# EAGLE schematic Transponder (EAGLE 9.5.1)
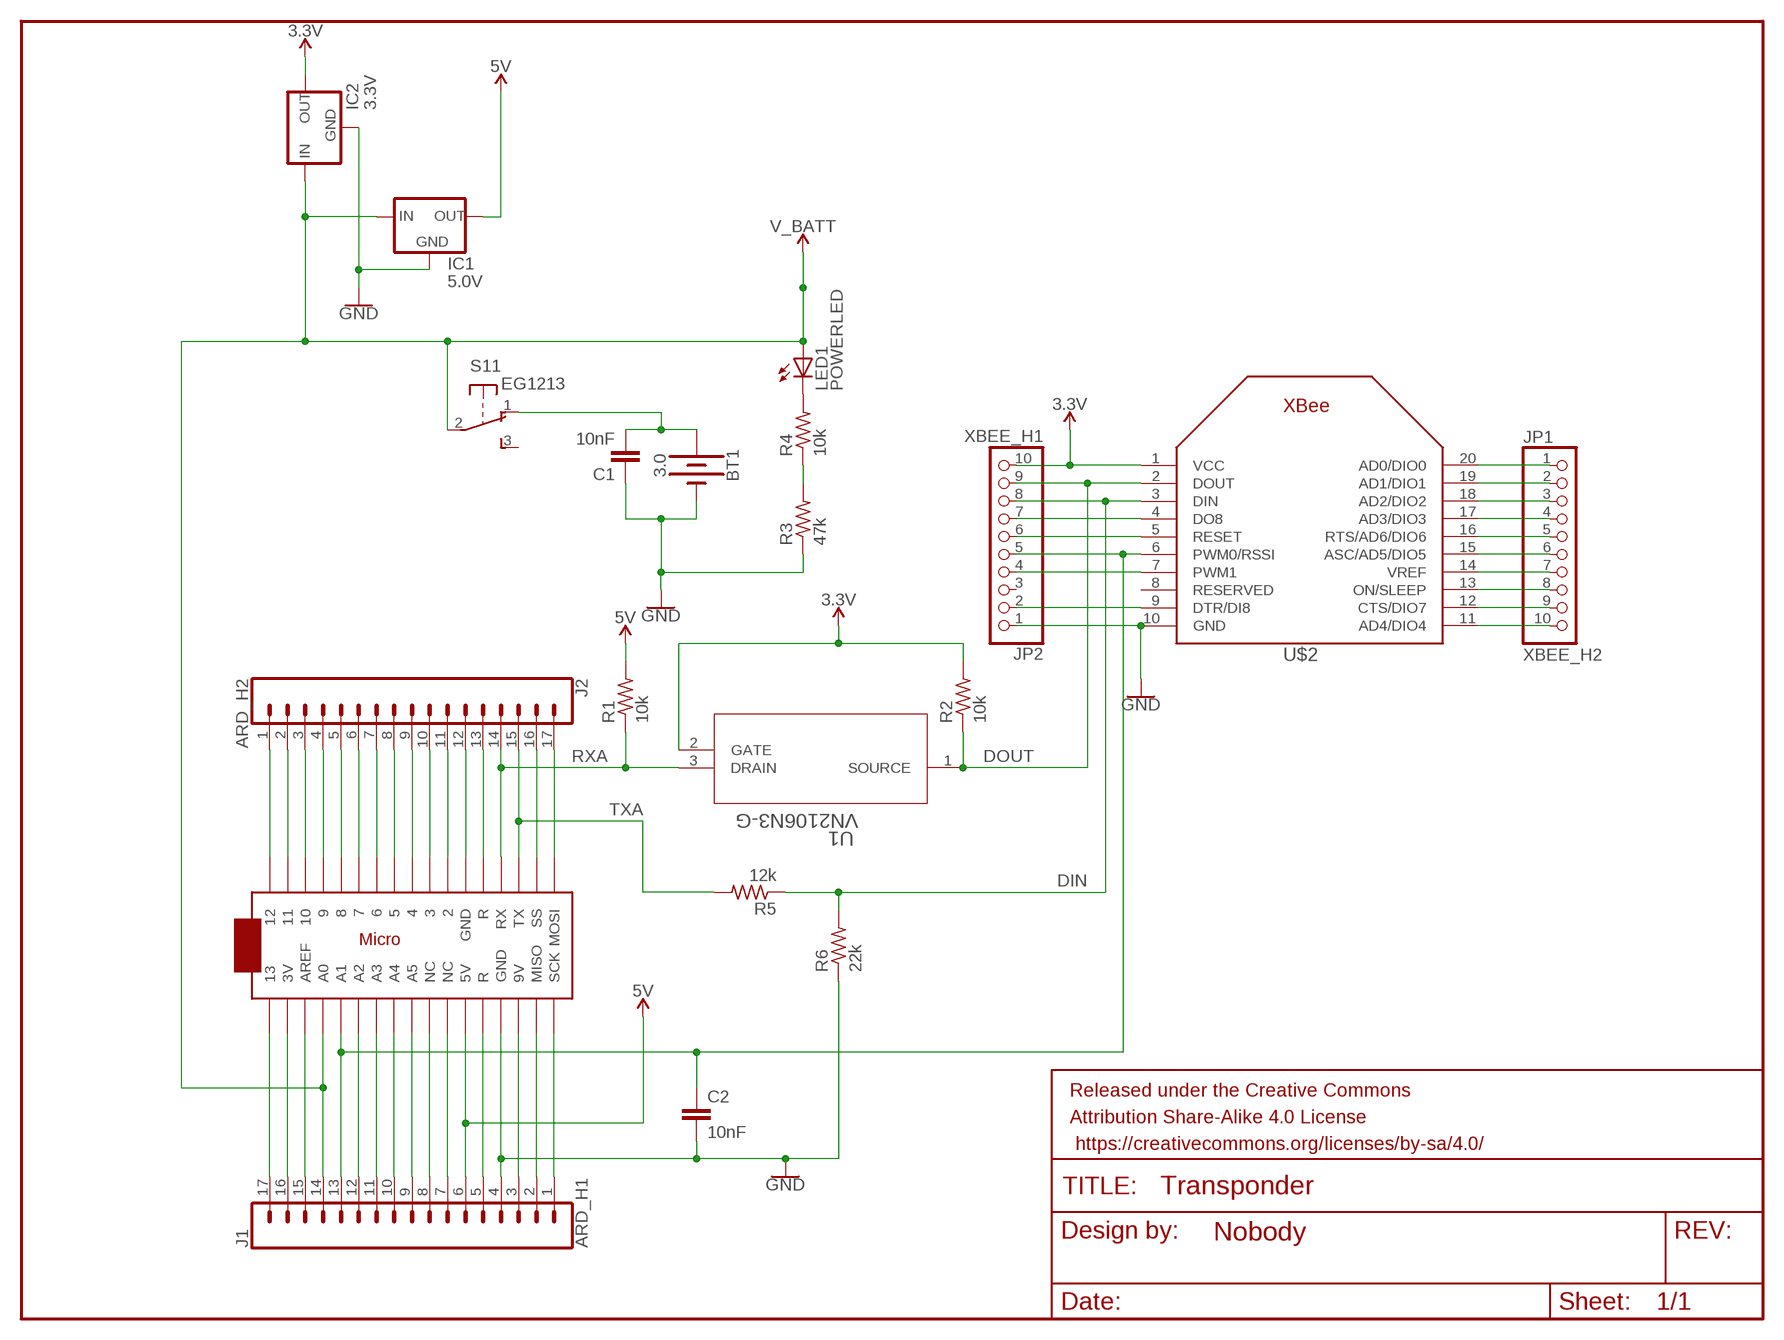
[diagram p0: schematic, sheet 1]

## Parts
BT1  3.0  BATTERY-20MM_SMD_4LEGS  [BATTCON_20MM_4LEGS]
C1  10nF  10NF-PTH-10MM-10000V-1-%  [CAP-PTH-10MM]
C2  10nF  10NF-PTH-10MM-10000V-1-%  [CAP-PTH-10MM]
FRAME1  FRAME-LETTERNO_PACKAGE  [DUMMY]
IC1  5.0V  MCP1700INLINE  [TO92-INLINE]
IC2  3.3V  MCP1700INLINE  [TO92-INLINE]
J1  ARD_H1  CONN_17  [1X17]
J2  ARD_H2  CONN_17  [1X17]
JP1  XBEE_H2  PINHD-1X10_2.00  [1X10M]
JP2  XBEE_H1  PINHD-1X10_2.00  [1X10M]
LED1  POWERLED  LED5MM  [LED5MM]
R1  10k  R-US_0207/12  [0207/12]
R2  10k  R-US_0207/12  [0207/12]
R3  47k  R-US_0207/12  [0207/12]
R4  10k  R-US_0207/12  [0207/12]
R5  12k  R-US_0207/12  [0207/12]
R6  22k  R-US_0207/12  [0207/12]
S1  EG1213  [EG1213]
U1  VN2106N3-G  [TO-92_MC]
U$1  ARDUINOMICRO  [ARDUINOMICRO]
U$2  XBEE  [XBEE]

## Nets
3.3V: IC2.3(OUT) JP2.10 R2.2 U1.2(GATE) U$2.1(VCC)
5V: IC1.3(OUT) J1.6 R1.2 U$1.P$23(5V)
DIN: JP2.8 R5.1 R6.2 U$2.3(DIN)
DOUT: JP2.9 R2.1 U1.1(SOURCE) U$2.2(DOUT)
GND: BT1.NEGATIVE(-) C1.1 C2.2 IC1.1(GND) IC2.1(GND) J1.4 JP2.1 R3.1 R6.1 U$1.P$12(GND) U$2.10(GND)
N$1: BT1.POSITIVE@1(+) BT1.POSITIVE@2(+) BT1.POSITIVE@3(+) BT1.POSITIVE@4(+) C1.2 S1.1(1:O)
N$4: LED1.K(C) R4.2
N$5: R3.2 R4.1
N$6: J1.17 U$1.P$34
N$7: J1.15 U$1.P$32(AREF)
N$9: J1.12 U$1.P$29(A2)
N$10: J1.11 U$1.P$28(A3)
N$11: J1.9 U$1.P$26(A5)
N$12: J1.10 U$1.P$27(A4)
N$13: J1.8 U$1.P$25(NC)
N$14: J1.7 U$1.P$24(NC)
N$15: J1.5 U$1.P$13(R)
N$16: J1.3 U$1.P$20(9V)
N$17: J1.2 U$1.P$19(MISO)
N$18: J1.1 U$1.P$18(SCK)
N$19: J2.17 U$1.P$17(MOSI)
N$20: J2.16 U$1.P$16(SS)
N$21: J2.13 U$1.P$22(R)
N$22: J2.12 U$1.P$21(GND)
N$23: J2.11 U$1.P$11
N$24: J2.10 U$1.P$10
N$25: J2.9 U$1.P$9
N$26: J2.7 U$1.P$7
N$28: J2.8 U$1.P$8
N$29: JP1.1 U$2.20(AD0/DIO0)
N$30: J2.6 U$1.P$6
N$31: J2.5 U$1.P$5
N$32: J2.4 U$1.P$4
N$33: J2.3 U$1.P$3
N$34: J2.2 U$1.P$2
N$35: J2.1 U$1.P$1
N$36: J1.16 U$1.P$33(3V)
N$37: JP1.2 U$2.19(AD1/DIO1)
N$38: JP1.3 U$2.18(AD2/DIO2)
N$39: JP1.4 U$2.17(AD3/DIO3)
N$40: JP1.5 U$2.16(RTS/AD6/DIO6)
N$41: JP1.6 U$2.15(ASC/AD5/DIO5)
N$42: JP1.7 U$2.14(VREF)
N$43: JP1.8 U$2.13(ON/SLEEP)
N$44: JP1.9 U$2.12(CTS/DIO7)
N$45: JP1.10 U$2.11(AD4/DIO4)
N$46: JP2.2 U$2.9(DTR/DI8)
N$47: JP2.4 U$2.7(PWM1)
N$48: C2.1 J1.13 JP2.5 U$1.P$30(A1) U$2.6(PWM0/RSSI)
N$49: JP2.6 U$2.5(RESET)
N$50: JP2.7 U$2.4(DO8)
RXA: J2.14 R1.1 U1.3(DRAIN) U$1.P$14(RX)
TXA: J2.15 R5.2 U$1.P$15(TX)
V_BATT: IC1.2(IN) IC2.2(IN) J1.14 LED1.A S1.2(1:P) U$1.P$31(A0)
Unconnected: JP2.3 S1.3(1:S) S1.MT1(MT) S1.MT2(MT) U$2.8(RESERVED)

## Library data of the parts
BT1 = SparkFun-Batteries:BATTERY: Battery - Single Cell A variety of battery chemistries, sizes, and footprints. Device List: 20MM_PTH - Coin Cell Battery Holder - 20mm (PTH) <https://www.sparkfun.com/products/783> 20MM_PTH_KIT- Coin Cell battery Holder - 20 mm (PTH) <http://www.sparkfun.com/products/783>kit version with special mask 6.8MM_PTH - Coin Cell Battery Holder - 6.8MM(SMD) <https://www.digikey.com/product-detail/en/seiko-instruments/MS621FE-FL11E/728-1057-ND/1889208?WT.srch=1&gclid=CNOQ5a6LzdQCFZS2wAodXCkE0g> 12MM_SMD - Coin Cell Battery Holder - 12mm (SMD) <https://www.sparkfun.com/products/10592> 12MM_PTH - Coin Cell Battery Holder - 12mm (PTH) <https://www.sparkfun.com/products/7948> 20MM_SMD - 20mm Coin Cell Battery Holder (SMD) (2 legs) Used on the Big Time Watch Kit <https://www.sparkfun.com/products/11734> 20MM_SMD_4LEGS - Coin Cell Battery Holder - 20mm (SMD) <https://www.sparkfun.com/products/11892> 20MM_SMD_4LEGS_OVERPASTE - Coin Cell Battery Holder - 20mm (SMD) <https://www.sparkfun.com/products/11892> (Over-paste on the legs) 24.5MM_PTH - Coin Cell Battery Holder - 24.5mm (PTH) <https://www.sparkfun.com/products/8863> 9V - 9V Battery Holder - PC Mount Used on the SparkFun SparkPunk Sound Kit <https://www.sparkfun.com/products/11177> and SparkFun SparkPunk Sequencer Kit <https://www.sparkfun.com/products/12707> 18650 - Battery Holder - 18650 (PTH) <https://www.sparkfun.com/products/13113> AA - Battery Holder - 1xAA (PTH) <https://www.sparkfun.com/products/7949> AAA - Battery Holder - 1xAAA (PTH) <https://www.sparkfun.com/products/12718> AA_KIT - Battery Holder - 1xAA (PTH) <https://www.sparkfun.com/products/7949> Special kit package - pads only have exposed copper on one side of the board. AAA_KIT - Battery Holder - 1xAAA (PTH) <https://www.sparkfun.com/products/12718> Special kit package - pads only have exposed copper on one side of the board.; PROD_ID: BATT-10373; SF_SKU: PRT-11892
C1 C2 = SparkFun-Capacitors:10NF: 0.01uF/10nF/10,000pF ceramic capacitors A capacitor is a passive two-terminal electrical component used to store electrical energy temporarily in an electric field. CAP-09321; PROD_ID: CAP-09321
FRAME1 = SparkFun-Aesthetics:FRAME-LETTER: Schematic Frame - Letter Standard 8.5x11 US Letter frame; DESIGNER: Nobody; VERSION: v01
IC1 IC2 = adafruit:MCP1700: VOLTAGE REGULATOR
J1 J2 = SparkFun-Connectors:CONN_17: Multi connection point. Often used as Generic Header-pin footprint for 0.1 inch spaced/style header connections On any of the 0.1 inch spaced packages, you can populate with these: Break Away Headers - Straight <https://www.sparkfun.com/products/116> (PRT-00116) Break Away Male Headers - Right Angle <https://www.sparkfun.com/products/553> (PRT-00553) Female Headers <https://www.sparkfun.com/products/115> (PRT-00115) Break Away Headers - Machine Pin <https://www.sparkfun.com/products/117> (PRT-00117) Break Away Female Headers - Swiss Machine Pin <https://www.sparkfun.com/products/743> (PRT-00743) For SCREWTERMINALS and SPRING TERMINALS visit here: Screw Terimnals on SparkFun.com <https://www.sparkfun.com/search/results?term=Screw+Terminals> (5mm/3.5mm/2.54mm spacing) This device is also useful as a general connection point to wire up your design to another part of your project. Our various solder wires solder well into these plated through hole pads. Hook-Up Wire - Assortment (Stranded, 22 AWG) <https://www.sparkfun.com/products/11375> (PRT-11375) Hook-Up Wire - Assortment (Solid Core, 22 AWG) <https://www.sparkfun.com/products/11367> (PRT-11367) View the entire wire category on our website here <https://www.sparkfun.com/categories/141> Special notes: Molex polarized connector foot print use with SKU : PRT-08231 with associated crimp pins and housings. 1MM SMD Version SKU: PRT-10208 NOTES ON THE VARIANTS LOCK and LOCK_LONGPADS... This footprint was designed to help hold the alignment of a through-hole component (i.e. 6-pin header) while soldering it into place. You may notice that each hole has been shifted either up or down by 0.005 of an inch from it's more standard position (which is a perfectly straight line). This slight alteration caused the pins (the squares in the middle) to touch the edges of the holes. Because they are alternating, it causes a "brace" to hold the component in place. 0.005 has proven to be the perfect amount of "off-center" position when using our standard breakaway headers. Although looks a little odd when you look at the bare footprint, once you have a header in there, the alteration is very hard to notice. Also,if you push a header all the way into place, it is covered up entirely on the bottom side.
JP1 JP2 = pinhead-2:PINHD-1X10: PIN HEADER
LED1 = led:LED: LED OSRAM: - CHIPLED LG R971, LG N971, LY N971, LG Q971, LY Q971, LO R971, LY R971 LH N974, LH R974 LS Q976, LO Q976, LY Q976 LO Q996 - Hyper CHIPLED LW Q18S LB Q993, LB Q99A, LB R99A - SideLED LS A670, LO A670, LY A670, LG A670, LP A670 LB A673, LV A673, LT A673, LW A673 LH A674 LY A675 LS A676, LA A676, LO A676, LY A676, LW A676 LS A679, LY A679, LG A679 - Hyper Micro SIDELED® LS Y876, LA Y876, LO Y876, LY Y876 LT Y87S - SmartLED LW L88C, LW L88S LB L89C, LB L89S, LG L890 LS L89K, LO L89K, LY L89K LS L896, LA L896, LO L896, LY L896 - TOPLED LS T670, LO T670, LY T670, LG T670, LP T670 LSG T670, LSP T670, LSY T670, LOP T670, LYG T670 LG T671, LOG T671, LSG T671 LB T673, LV T673, LT T673, LW T673 LH T674 LS T676, LA T676, LO T676, LY T676, LB T676, LH T676, LSB T676, LW T676 LB T67C, LV T67C, LT T67C, LS T67K, LO T67K, LY T67K, LW E67C LS E67B, LA E67B, LO E67B, LY E67B, LB E67C, LV E67C, LT E67C LW T67C LS T679, LY T679, LG T679 LS T770, LO T770, LY T770, LG T770, LP T770 LB T773, LV T773, LT T773, LW T773 LH T774 LS E675, LA E675, LY E675, LS T675 LS T776, LA T776, LO T776, LY T776, LB T776 LHGB T686 LT T68C, LB T68C - Hyper Mini TOPLED® LB M676 - Mini TOPLED Santana® LG M470 LS M47K, LO M47K, LY M47K Source: http://www.osram.convergy.de LUXEON: - LUMILED® LXK2-PW12-R00, LXK2-PW12-S00, LXK2-PW14-U00, LXK2-PW14-V00 LXK2-PM12-R00, LXK2-PM12-S00, LXK2-PM14-U00 LXK2-PE12-Q00, LXK2-PE12-R00, LXK2-PE12-S00, LXK2-PE14-T00, LXK2-PE14-U00 LXK2-PB12-K00, LXK2-PB12-L00, LXK2-PB12-M00, LXK2-PB14-N00, LXK2-PB14-P00, LXK2-PB14-Q00 LXK2-PR12-L00, LXK2-PR12-M00, LXK2-PR14-Q00, LXK2-PR14-R00 LXK2-PD12-Q00, LXK2-PD12-R00, LXK2-PD12-S00 LXK2-PH12-R00, LXK2-PH12-S00 LXK2-PL12-P00, LXK2-PL12-Q00, LXK2-PL12-R00 Source: www.luxeon.com KINGBRIGHT: KA-3528ASYC Source: www.kingbright.com
R1-R6 = resistor:R-US_: RESISTOR, American symbol
S1 = adafruit:EG1213: E-Switch right-angle slide SPDT Part #EG1213 http://www.ladyada.net/library/eagle
U1 = VN2106N3-G:VN2106N3-G; BUILT_BY: EMA_Jessica; COPYRIGHT: Copyright (C) 2018 Accelerated Designs. All rights reserved; MANUFACTURER_PART_NUMBER: VN2106N3-G; VENDOR: Microchip
U$1 = adafruit:ARDUINOMICRO
U$2 = adafruit:XBEE

## Net classes
0 default: clearance 0.205 mm